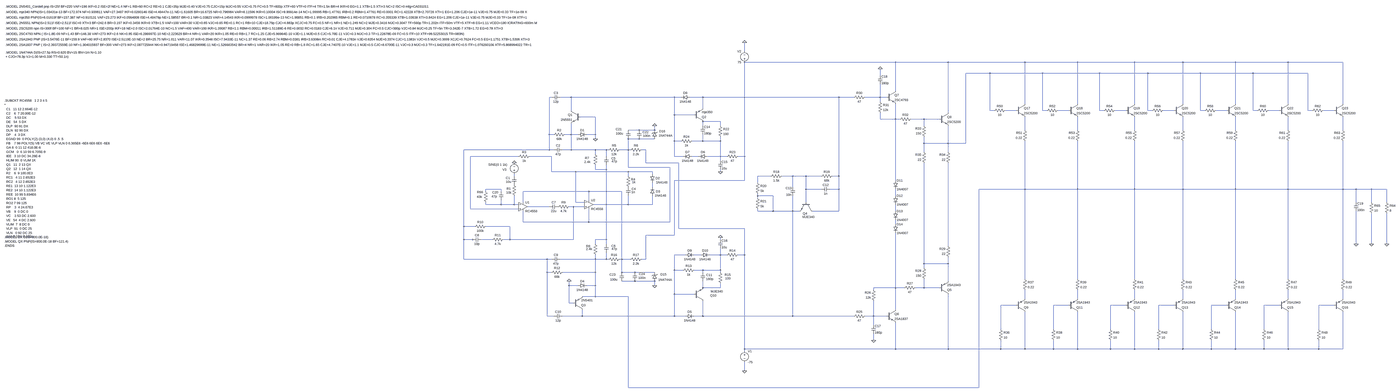
[diagram p0: schematic amplifier.asc, whole sheet]
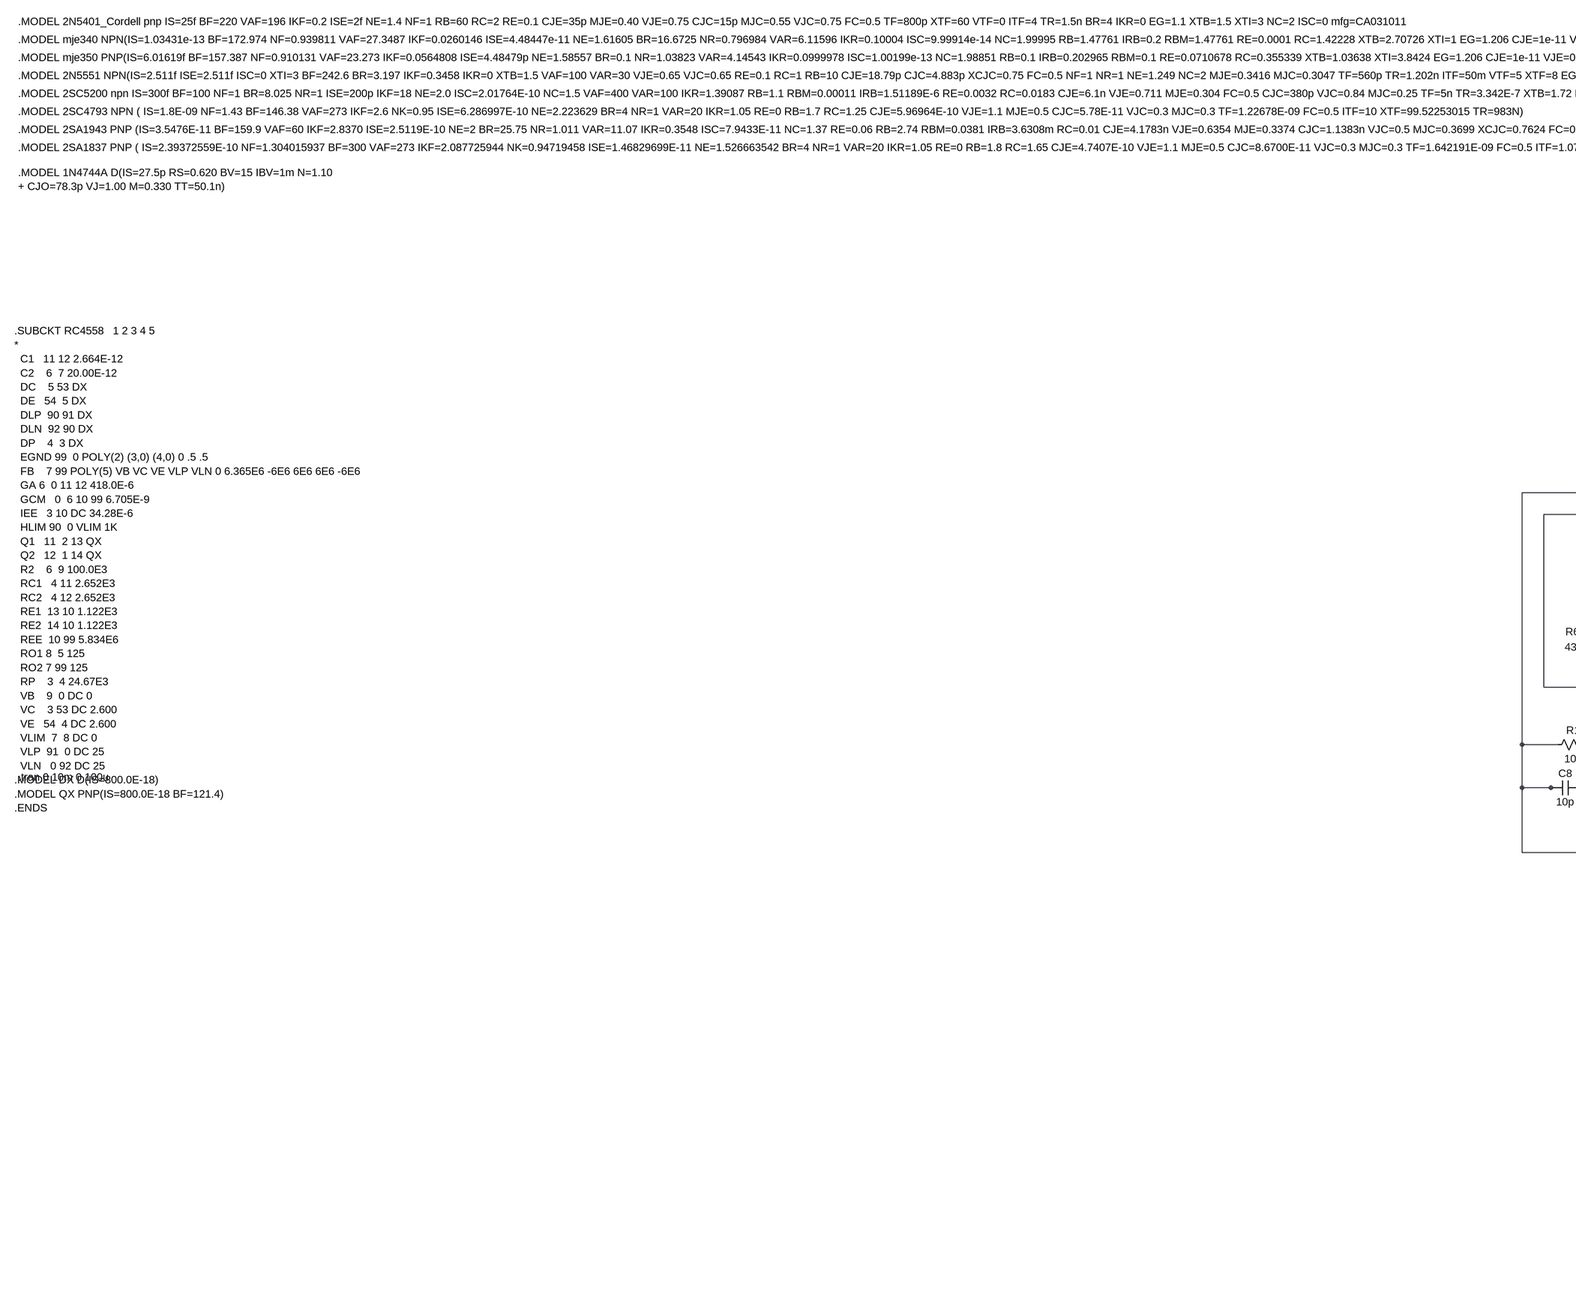
[diagram p1: schematic amplifier.asc, part, row 1 of 1, column 1 of 3]
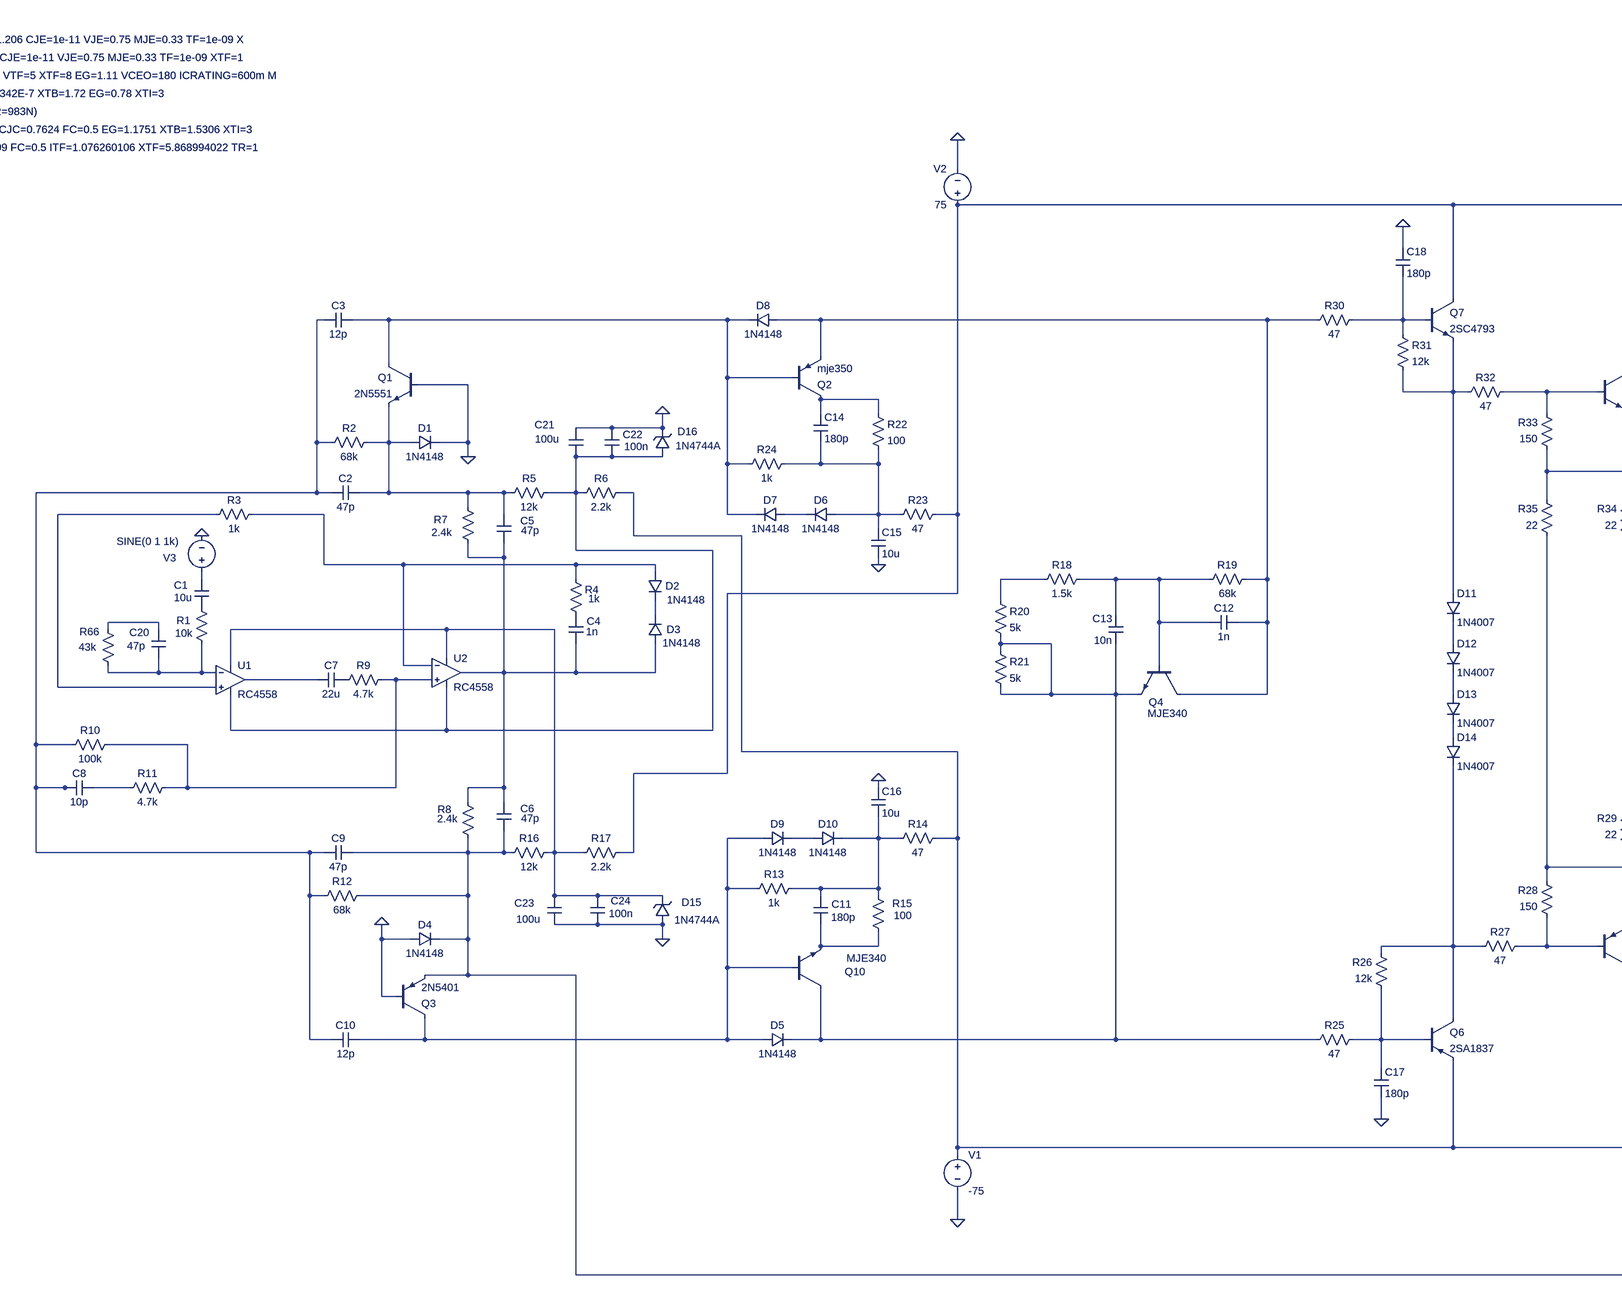
[diagram p2: schematic amplifier.asc, part, row 1 of 1, column 2 of 3]
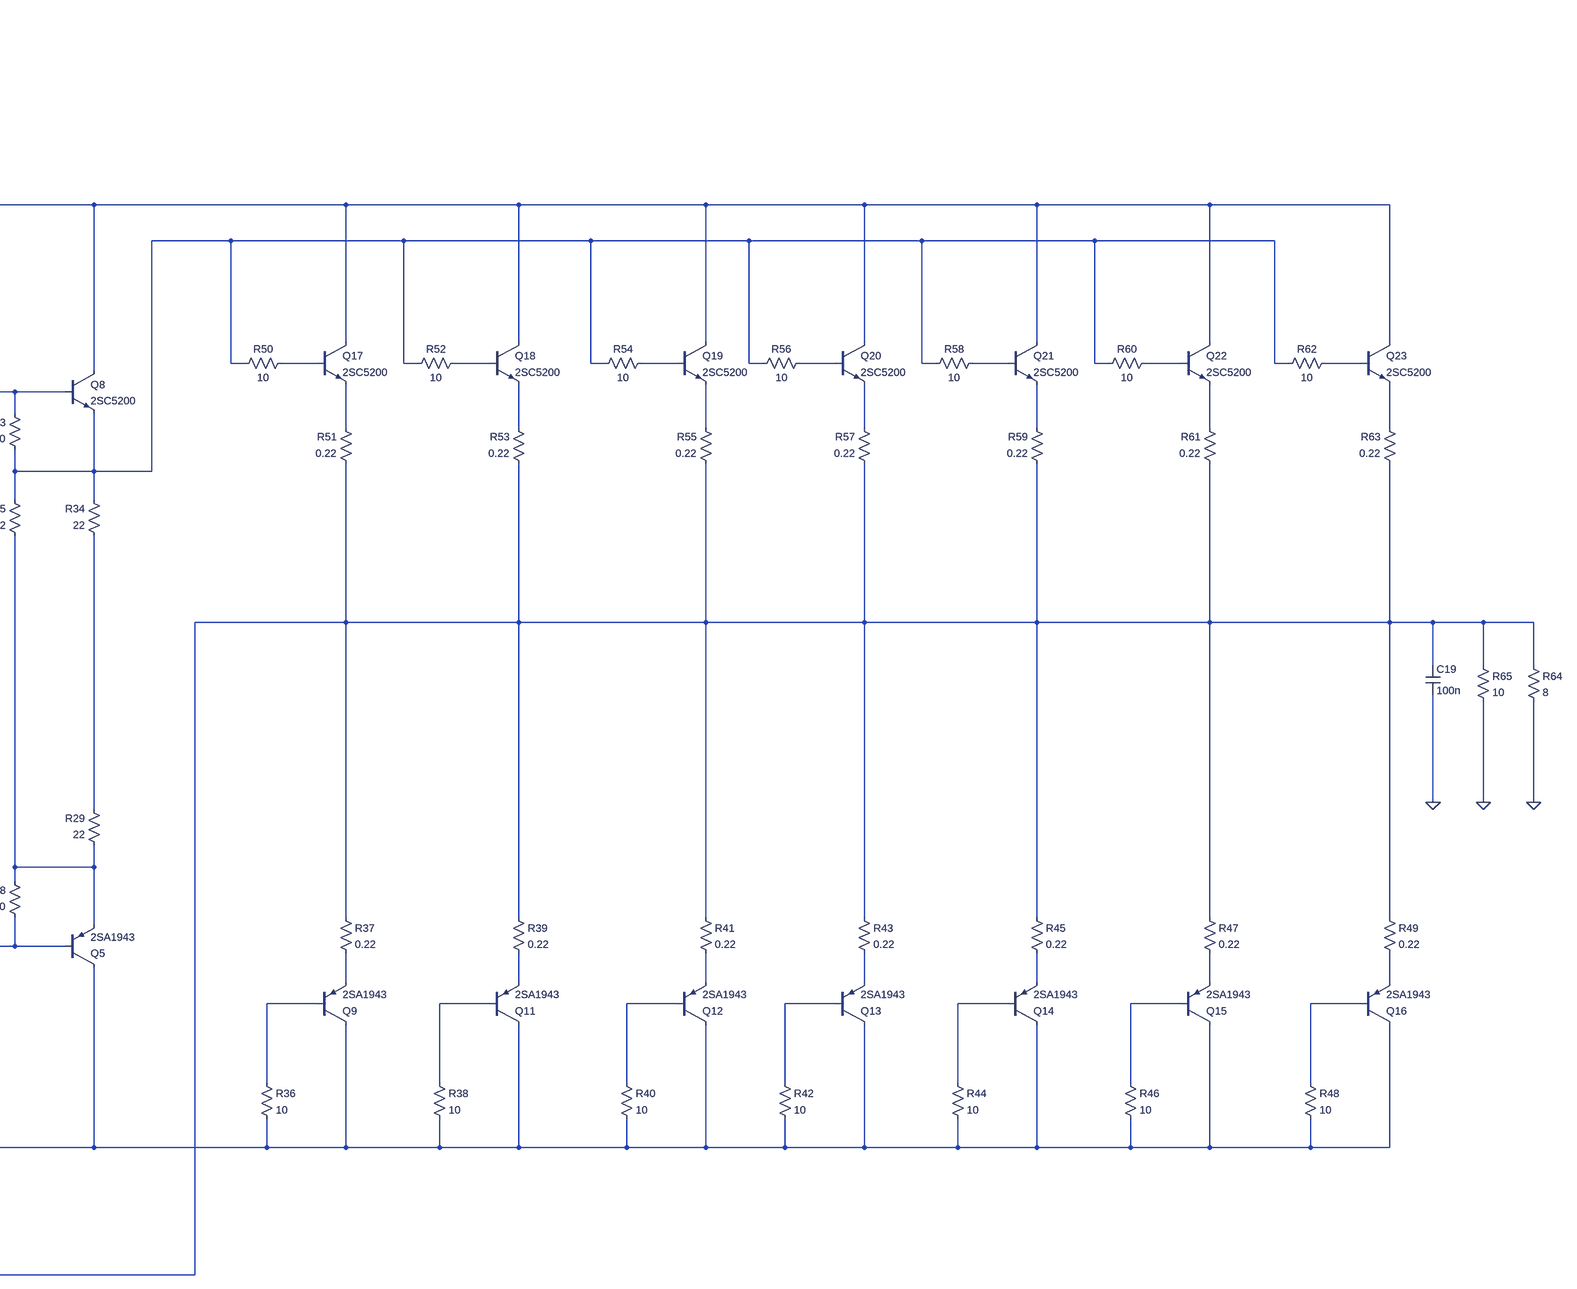
[diagram p3: schematic amplifier.asc, part, row 1 of 1, column 3 of 3]
amplifier.asc, the LTspice schematic file:
Version 4
SHEET 1 6164 1556
WIRE 1168 -1120 1168 -1184
WIRE 2400 -1040 1168 -1040
WIRE 2784 -1040 2400 -1040
WIRE 3344 -1040 2784 -1040
WIRE 3728 -1040 3344 -1040
WIRE 4144 -1040 3728 -1040
WIRE 4496 -1040 4144 -1040
WIRE 4880 -1040 4496 -1040
WIRE 5264 -1040 4880 -1040
WIRE 5664 -1040 5264 -1040
WIRE 3088 -960 2912 -960
WIRE 3472 -960 3088 -960
WIRE 3888 -960 3472 -960
WIRE 4240 -960 3888 -960
WIRE 4624 -960 4240 -960
WIRE 5008 -960 4624 -960
WIRE 5408 -960 5008 -960
WIRE 2288 -944 2288 -992
WIRE 2400 -832 2400 -1040
WIRE -240 -784 -256 -784
WIRE -96 -784 -176 -784
WIRE 656 -784 -96 -784
WIRE 704 -784 656 -784
WIRE 864 -784 768 -784
WIRE 1856 -784 864 -784
WIRE 2096 -784 1856 -784
WIRE 2288 -784 2288 -880
WIRE 2288 -784 2176 -784
WIRE 2336 -784 2288 -784
WIRE 2288 -752 2288 -784
WIRE 3344 -736 3344 -1040
WIRE 3728 -736 3728 -1040
WIRE 4144 -736 4144 -1040
WIRE 4496 -736 4496 -1040
WIRE 4880 -736 4880 -1040
WIRE 5264 -736 5264 -1040
WIRE 5664 -736 5664 -1040
WIRE 864 -704 864 -784
WIRE -96 -688 -96 -784
WIRE 3088 -688 3088 -960
WIRE 3120 -688 3088 -688
WIRE 3280 -688 3200 -688
WIRE 3472 -688 3472 -960
WIRE 3504 -688 3472 -688
WIRE 3664 -688 3584 -688
WIRE 3888 -688 3888 -960
WIRE 3920 -688 3888 -688
WIRE 4080 -688 4000 -688
WIRE 4240 -688 4240 -960
WIRE 4272 -688 4240 -688
WIRE 4432 -688 4352 -688
WIRE 4624 -688 4624 -960
WIRE 4656 -688 4624 -688
WIRE 4816 -688 4736 -688
WIRE 5008 -688 5008 -960
WIRE 5040 -688 5008 -688
WIRE 5200 -688 5120 -688
WIRE 5408 -688 5408 -960
WIRE 5440 -688 5408 -688
WIRE 5600 -688 5520 -688
WIRE 2784 -672 2784 -1040
WIRE 656 -656 656 -784
WIRE 800 -656 656 -656
WIRE 80 -640 -32 -640
WIRE 2288 -624 2288 -672
WIRE 2400 -624 2400 -736
WIRE 2400 -624 2288 -624
WIRE 2432 -624 2400 -624
WIRE 2608 -624 2512 -624
WIRE 2720 -624 2608 -624
WIRE 992 -608 864 -608
WIRE 864 -576 864 -608
WIRE 992 -576 992 -608
WIRE 2608 -576 2608 -624
WIRE 400 -544 320 -544
WIRE 512 -544 512 -576
WIRE 512 -544 400 -544
WIRE 3344 -544 3344 -640
WIRE 3728 -544 3728 -640
WIRE 4144 -544 4144 -640
WIRE 4496 -544 4496 -640
WIRE 4880 -544 4880 -640
WIRE 5264 -544 5264 -640
WIRE 5664 -544 5664 -640
WIRE -256 -512 -256 -784
WIRE -224 -512 -256 -512
WIRE -96 -512 -96 -592
WIRE -96 -512 -144 -512
WIRE -48 -512 -96 -512
WIRE 80 -512 80 -640
WIRE 80 -512 16 -512
WIRE 80 -480 80 -512
WIRE 400 -480 320 -480
WIRE 512 -480 400 -480
WIRE 656 -464 656 -656
WIRE 704 -464 656 -464
WIRE 864 -464 864 -512
WIRE 864 -464 784 -464
WIRE 992 -464 992 -496
WIRE 992 -464 864 -464
WIRE 2608 -448 2608 -496
WIRE 2784 -448 2784 -576
WIRE 2784 -448 2608 -448
WIRE 2912 -448 2912 -960
WIRE 2912 -448 2784 -448
WIRE -256 -400 -256 -512
WIRE -256 -400 -880 -400
WIRE -224 -400 -256 -400
WIRE -96 -400 -96 -512
WIRE -96 -400 -160 -400
WIRE 80 -400 -96 -400
WIRE 160 -400 80 -400
WIRE 176 -400 160 -400
WIRE 320 -400 320 -480
WIRE 320 -400 256 -400
WIRE 336 -400 320 -400
WIRE 448 -400 416 -400
WIRE 2608 -384 2608 -448
WIRE 2784 -384 2784 -448
WIRE 80 -368 80 -400
WIRE -480 -352 -832 -352
WIRE -240 -352 -400 -352
WIRE 160 -352 160 -400
WIRE 656 -352 656 -464
WIRE 720 -352 656 -352
WIRE 832 -352 784 -352
WIRE 992 -352 992 -464
WIRE 992 -352 896 -352
WIRE 1040 -352 992 -352
WIRE 1168 -352 1168 -1040
WIRE 1168 -352 1120 -352
WIRE 992 -320 992 -352
WIRE 448 -304 448 -400
WIRE 688 -304 448 -304
WIRE 320 -272 320 -400
WIRE 624 -272 320 -272
WIRE 80 -256 80 -288
WIRE 160 -256 160 -288
WIRE 160 -256 80 -256
WIRE -240 -240 -240 -352
WIRE -64 -240 -240 -240
WIRE 320 -240 -64 -240
WIRE 496 -240 320 -240
WIRE 992 -240 992 -256
WIRE 496 -224 496 -240
WIRE -512 -208 -512 -224
WIRE 320 -208 320 -240
WIRE 1360 -208 1264 -208
WIRE 1520 -208 1440 -208
WIRE 1616 -208 1520 -208
WIRE 1728 -208 1616 -208
WIRE 1856 -208 1856 -784
WIRE 1856 -208 1808 -208
WIRE 1168 -176 1168 -352
WIRE 1168 -176 656 -176
WIRE 2400 -176 2400 -624
WIRE 1264 -160 1264 -208
WIRE 496 -128 496 -160
WIRE 1520 -128 1520 -208
WIRE -608 -112 -720 -112
WIRE 1616 -112 1616 -208
WIRE 1728 -112 1616 -112
WIRE 1856 -112 1856 -208
WIRE 1856 -112 1792 -112
WIRE 3344 -112 3344 -464
WIRE 3344 -112 3008 -112
WIRE 3728 -112 3728 -464
WIRE 3728 -112 3344 -112
WIRE 4144 -112 4144 -464
WIRE 4144 -112 3728 -112
WIRE 4496 -112 4496 -464
WIRE 4496 -112 4144 -112
WIRE 4880 -112 4880 -464
WIRE 4880 -112 4496 -112
WIRE 5264 -112 5264 -464
WIRE 5264 -112 4880 -112
WIRE 5664 -112 5664 -464
WIRE 5664 -112 5264 -112
WIRE 5760 -112 5664 -112
WIRE 5872 -112 5760 -112
WIRE 5984 -112 5872 -112
WIRE -720 -96 -720 -112
WIRE -608 -96 -608 -112
WIRE 32 -96 -448 -96
WIRE 272 -96 32 -96
WIRE 1264 -64 1264 -80
WIRE 1376 -64 1264 -64
WIRE 2400 -64 2400 -112
WIRE 1264 -48 1264 -64
WIRE 32 -32 32 -96
WIRE -448 -16 -448 -96
WIRE -64 -16 -64 -240
WIRE 0 -16 -64 -16
WIRE 1616 -16 1616 -112
WIRE 5760 -16 5760 -112
WIRE 5872 -16 5872 -112
WIRE 5984 -16 5984 -112
WIRE -720 0 -720 -16
WIRE -608 0 -608 -32
WIRE -608 0 -720 0
WIRE -512 0 -512 -64
WIRE -512 0 -608 0
WIRE -480 0 -512 0
WIRE 160 0 160 -256
WIRE 160 0 64 0
WIRE 320 0 320 -64
WIRE 320 0 160 0
WIRE 496 0 496 -64
WIRE 496 0 320 0
WIRE -256 16 -416 16
WIRE -80 16 -112 16
WIRE 0 16 -80 16
WIRE -832 32 -832 -352
WIRE -480 32 -832 32
WIRE 1264 48 1264 32
WIRE 1376 48 1376 -64
WIRE 1376 48 1264 48
WIRE 1520 48 1520 -64
WIRE 1520 48 1376 48
WIRE 1568 48 1520 48
WIRE 1856 48 1856 -112
WIRE 1856 48 1664 48
WIRE 2400 48 2400 0
WIRE -448 128 -448 48
WIRE 32 128 32 32
WIRE 32 128 -448 128
WIRE 624 128 624 -272
WIRE 624 128 32 128
WIRE 2400 144 2400 112
WIRE -880 160 -880 -400
WIRE -800 160 -880 160
WIRE -544 160 -720 160
WIRE 688 176 688 -304
WIRE 1168 176 688 176
WIRE 656 224 656 -176
WIRE 656 224 448 224
WIRE -880 256 -880 160
WIRE -816 256 -880 256
WIRE -800 256 -816 256
WIRE -672 256 -752 256
WIRE -544 256 -544 160
WIRE -544 256 -592 256
WIRE -80 256 -80 16
WIRE -80 256 -544 256
WIRE 160 256 160 0
WIRE 160 256 80 256
WIRE 992 256 992 240
WIRE 80 288 80 256
WIRE 160 288 160 256
WIRE 5760 288 5760 48
WIRE 5872 288 5872 64
WIRE 5984 288 5984 64
WIRE 2784 304 2784 -304
WIRE 736 368 656 368
WIRE 848 368 800 368
WIRE 992 368 992 320
WIRE 992 368 912 368
WIRE 1040 368 992 368
WIRE 1168 368 1168 176
WIRE 1168 368 1120 368
WIRE -880 400 -880 256
WIRE -272 400 -880 400
WIRE -240 400 -272 400
WIRE 80 400 80 368
WIRE 80 400 -176 400
WIRE 160 400 160 352
WIRE 160 400 80 400
WIRE 176 400 160 400
WIRE 272 400 272 -96
WIRE 272 400 256 400
WIRE 336 400 272 400
WIRE 448 400 448 224
WIRE 448 400 416 400
WIRE 2608 432 2608 -304
WIRE 2784 432 2784 384
WIRE 2784 432 2608 432
WIRE 2608 464 2608 432
WIRE 656 480 656 368
WIRE 720 480 656 480
WIRE 864 480 800 480
WIRE 992 480 992 368
WIRE 992 480 864 480
WIRE -272 496 -272 400
WIRE -240 496 -272 496
WIRE 80 496 80 400
WIRE 80 496 -160 496
WIRE 272 496 272 400
WIRE 368 496 272 496
WIRE 512 496 368 496
WIRE 864 496 864 480
WIRE 992 496 992 480
WIRE 3344 544 3344 -112
WIRE 3728 544 3728 -112
WIRE 4144 544 4144 -112
WIRE 4496 544 4496 -112
WIRE 4880 544 4880 -112
WIRE 5264 544 5264 -112
WIRE 5664 544 5664 -112
WIRE 368 560 272 560
WIRE 512 560 368 560
WIRE 2784 560 2784 432
WIRE -112 592 -112 560
WIRE -48 592 -112 592
WIRE 80 592 80 496
WIRE 80 592 16 592
WIRE 512 592 512 560
WIRE 864 608 864 560
WIRE 992 608 992 576
WIRE 992 608 864 608
WIRE 2400 608 2400 208
WIRE 2400 608 2240 608
WIRE 2464 608 2400 608
WIRE 2608 608 2608 544
WIRE 2608 608 2544 608
WIRE 2720 608 2608 608
WIRE 2240 624 2240 608
WIRE 656 656 656 480
WIRE 800 656 656 656
WIRE 80 672 80 592
WIRE 80 672 -16 672
WIRE 320 672 80 672
WIRE 3344 688 3344 624
WIRE 3728 688 3728 624
WIRE 4144 688 4144 624
WIRE 4496 688 4496 624
WIRE 4880 688 4880 624
WIRE 5264 688 5264 624
WIRE 5664 688 5664 624
WIRE -112 720 -112 592
WIRE -80 720 -112 720
WIRE 3280 736 3168 736
WIRE 3664 736 3552 736
WIRE 4080 736 3968 736
WIRE 4432 736 4320 736
WIRE 4816 736 4704 736
WIRE 5200 736 5088 736
WIRE 5600 736 5488 736
WIRE 2400 768 2400 608
WIRE -272 816 -272 496
WIRE -224 816 -272 816
WIRE -16 816 -16 768
WIRE -16 816 -160 816
WIRE 656 816 656 656
WIRE 656 816 -16 816
WIRE 736 816 656 816
WIRE 864 816 864 704
WIRE 864 816 800 816
WIRE 1520 816 1520 48
WIRE 1520 816 864 816
WIRE 2096 816 1520 816
WIRE 2240 816 2240 704
WIRE 2240 816 2176 816
WIRE 2336 816 2240 816
WIRE 2240 880 2240 816
WIRE 3168 912 3168 736
WIRE 3552 912 3552 736
WIRE 3968 912 3968 736
WIRE 4320 912 4320 736
WIRE 4704 912 4704 736
WIRE 5088 912 5088 736
WIRE 5488 912 5488 736
WIRE 2240 992 2240 944
WIRE 1168 1056 1168 368
WIRE 2400 1056 2400 864
WIRE 2400 1056 1168 1056
WIRE 2784 1056 2784 656
WIRE 2784 1056 2400 1056
WIRE 3168 1056 3168 992
WIRE 3168 1056 2784 1056
WIRE 3344 1056 3344 784
WIRE 3344 1056 3168 1056
WIRE 3552 1056 3552 992
WIRE 3552 1056 3344 1056
WIRE 3728 1056 3728 784
WIRE 3728 1056 3552 1056
WIRE 3968 1056 3968 992
WIRE 3968 1056 3728 1056
WIRE 4144 1056 4144 784
WIRE 4144 1056 3968 1056
WIRE 4320 1056 4320 992
WIRE 4320 1056 4144 1056
WIRE 4496 1056 4496 784
WIRE 4496 1056 4320 1056
WIRE 4704 1056 4704 992
WIRE 4704 1056 4496 1056
WIRE 4880 1056 4880 784
WIRE 4880 1056 4704 1056
WIRE 5088 1056 5088 992
WIRE 5088 1056 4880 1056
WIRE 5264 1056 5264 784
WIRE 5264 1056 5088 1056
WIRE 5488 1056 5488 992
WIRE 5488 1056 5264 1056
WIRE 5664 1056 5664 784
WIRE 5664 1056 5488 1056
WIRE 1168 1072 1168 1056
WIRE 1168 1216 1168 1152
WIRE 320 1552 320 672
WIRE 3008 1552 3008 -112
WIRE 3008 1552 320 1552
FLAG 80 -480 0
FLAG -112 560 0
FLAG 1168 1216 0
FLAG 1168 -1184 0
FLAG 992 240 0
FLAG 992 -240 0
FLAG 2240 992 0
FLAG 2288 -992 0
FLAG 5984 288 0
FLAG 5872 288 0
FLAG 5760 288 0
FLAG -512 -304 0
FLAG 512 592 0
FLAG 512 -576 0
SYMBOL npn -32 -688 M0
SYMATTR InstName Q1
SYMATTR Value 2N5551
SYMBOL pnp 800 -608 M180
SYMATTR InstName Q2
SYMATTR Value mje350
SYMBOL pnp -80 768 M180
SYMATTR InstName Q3
SYMATTR Value 2N5401
SYMBOL npn 1664 -16 R90
WINDOW 0 82 39 VRight 2
WINDOW 3 107 -15 VRight 2
SYMATTR InstName Q4
SYMATTR Value MJE340
SYMBOL OpAmps\\opamp2 -448 -48 R0
SYMATTR InstName U1
SYMATTR Value RC4558
SYMBOL OpAmps\\opamp2 32 -64 R0
SYMATTR InstName U2
SYMATTR Value RC4558
SYMBOL res -496 -48 R180
WINDOW 0 41 68 Left 2
WINDOW 3 36 40 Left 2
SYMATTR InstName R1
SYMATTR Value 10k
SYMBOL cap -496 -144 R180
WINDOW 0 47 50 Left 2
WINDOW 3 37 23 Left 2
SYMATTR InstName C1
SYMATTR Value 10u
SYMBOL diode -48 -496 R270
WINDOW 0 32 32 VTop 2
WINDOW 3 0 32 VBottom 2
SYMATTR InstName D1
SYMATTR Value 1N4148
SYMBOL res -128 -528 R90
WINDOW 0 0 56 VBottom 2
WINDOW 3 32 56 VTop 2
SYMATTR InstName R2
SYMATTR Value 68k
SYMBOL cap -160 -416 R90
WINDOW 0 0 32 VBottom 2
WINDOW 3 32 32 VTop 2
SYMATTR InstName C2
SYMATTR Value 47p
SYMBOL cap -176 -800 R90
WINDOW 0 0 32 VBottom 2
WINDOW 3 32 32 VTop 2
SYMATTR InstName C3
SYMATTR Value 12p
SYMBOL res -384 -368 R90
WINDOW 0 0 56 VBottom 2
WINDOW 3 32 56 VTop 2
SYMATTR InstName R3
SYMATTR Value 1k
SYMBOL res 304 -224 R0
WINDOW 3 43 60 Left 2
SYMATTR Value 1k
SYMATTR InstName R4
SYMBOL cap 304 -128 R0
WINDOW 0 40 14 Left 2
WINDOW 3 38 37 Left 2
SYMATTR InstName C4
SYMATTR Value 1n
SYMBOL diode 480 -224 R0
WINDOW 0 39 31 Left 2
WINDOW 3 42 62 Left 2
SYMATTR InstName D2
SYMATTR Value 1N4148
SYMBOL diode 512 -64 R180
WINDOW 0 -40 32 Left 2
WINDOW 3 -85 2 Left 2
SYMATTR InstName D3
SYMATTR Value 1N4148
SYMBOL res 272 -416 R90
WINDOW 0 0 56 VBottom 2
WINDOW 3 32 56 VTop 2
SYMATTR InstName R5
SYMATTR Value 12k
SYMBOL res 432 -416 R90
WINDOW 0 0 56 VBottom 2
WINDOW 3 32 56 VTop 2
SYMATTR InstName R6
SYMATTR Value 2.2k
SYMBOL res 96 -272 R180
WINDOW 0 61 68 Left 2
WINDOW 3 51 40 Left 2
SYMATTR InstName R7
SYMATTR Value 2.4k
SYMBOL cap 144 -352 R0
WINDOW 0 52 14 Left 2
WINDOW 3 54 36 Left 2
SYMATTR InstName C5
SYMATTR Value 47p
SYMBOL res 64 272 R0
WINDOW 0 -52 32 Left 2
WINDOW 3 -53 53 Left 2
SYMATTR InstName R8
SYMATTR Value 2.4k
SYMBOL cap -192 0 R90
WINDOW 0 0 32 VBottom 2
WINDOW 3 32 32 VTop 2
SYMATTR InstName C7
SYMATTR Value 22u
SYMBOL res -96 0 R90
WINDOW 0 0 56 VBottom 2
WINDOW 3 32 56 VTop 2
SYMATTR InstName R9
SYMATTR Value 4.7k
SYMBOL res -704 144 R90
WINDOW 0 0 56 VBottom 2
WINDOW 3 32 56 VTop 2
SYMATTR InstName R10
SYMATTR Value 100k
SYMBOL cap -752 240 R90
WINDOW 0 0 32 VBottom 2
WINDOW 3 32 32 VTop 2
SYMATTR InstName C8
SYMATTR Value 10p
SYMBOL res -576 240 R90
WINDOW 0 0 56 VBottom 2
WINDOW 3 32 56 VTop 2
SYMATTR InstName R11
SYMATTR Value 4.7k
SYMBOL diode -48 608 R270
WINDOW 0 32 32 VTop 2
WINDOW 3 0 32 VBottom 2
SYMATTR InstName D4
SYMATTR Value 1N4148
SYMBOL cap -176 384 R90
WINDOW 0 0 32 VBottom 2
WINDOW 3 32 32 VTop 2
SYMATTR InstName C9
SYMATTR Value 47p
SYMBOL res -144 480 R90
WINDOW 0 0 56 VBottom 2
WINDOW 3 32 56 VTop 2
SYMATTR InstName R12
SYMATTR Value 68k
SYMBOL cap 144 288 R0
WINDOW 0 52 14 Left 2
WINDOW 3 54 36 Left 2
SYMATTR InstName C6
SYMATTR Value 47p
SYMBOL cap -160 800 R90
WINDOW 0 0 32 VBottom 2
WINDOW 3 32 32 VTop 2
SYMATTR InstName C10
SYMATTR Value 12p
SYMBOL diode 736 832 R270
WINDOW 0 32 32 VTop 2
WINDOW 3 0 32 VBottom 2
SYMATTR InstName D5
SYMATTR Value 1N4148
SYMBOL res 816 464 R90
WINDOW 0 0 56 VBottom 2
WINDOW 3 32 56 VTop 2
SYMATTR InstName R13
SYMATTR Value 1k
SYMBOL diode 896 -336 M270
WINDOW 0 32 32 VTop 2
WINDOW 3 0 32 VBottom 2
SYMATTR InstName D6
SYMATTR Value 1N4148
SYMBOL diode 784 -336 M270
WINDOW 0 32 32 VTop 2
WINDOW 3 0 32 VBottom 2
SYMATTR InstName D7
SYMATTR Value 1N4148
SYMBOL res 1136 352 R90
WINDOW 0 0 56 VBottom 2
WINDOW 3 32 56 VTop 2
SYMATTR InstName R14
SYMATTR Value 47
SYMBOL res 1008 592 R180
WINDOW 0 -59 79 Left 2
WINDOW 3 -59 52 Left 2
SYMATTR InstName R15
SYMATTR Value 100
SYMBOL cap 848 496 R0
WINDOW 0 40 19 Left 2
WINDOW 3 39 48 Left 2
SYMATTR InstName C11
SYMATTR Value 180p
SYMBOL res 272 384 R90
WINDOW 0 0 56 VBottom 2
WINDOW 3 32 56 VTop 2
SYMATTR InstName R16
SYMATTR Value 12k
SYMBOL res 432 384 R90
WINDOW 0 0 56 VBottom 2
WINDOW 3 32 56 VTop 2
SYMATTR InstName R17
SYMATTR Value 2.2k
SYMBOL res 1456 -224 R90
WINDOW 0 0 56 VBottom 2
WINDOW 3 32 56 VTop 2
SYMATTR InstName R18
SYMATTR Value 1.5k
SYMBOL res 1824 -224 R90
WINDOW 0 0 56 VBottom 2
WINDOW 3 32 56 VTop 2
SYMATTR InstName R19
SYMATTR Value 68k
SYMBOL cap 1792 -128 R90
WINDOW 0 0 32 VBottom 2
WINDOW 3 32 32 VTop 2
SYMATTR InstName C12
SYMATTR Value 1n
SYMBOL cap 1536 -64 R180
WINDOW 0 24 56 Left 2
WINDOW 3 24 8 Left 2
SYMATTR InstName C13
SYMATTR Value 10n
SYMBOL res 1248 -176 R0
SYMATTR InstName R20
SYMATTR Value 5k
SYMBOL res 1248 -64 R0
SYMATTR InstName R21
SYMATTR Value 5k
SYMBOL diode 768 -800 R90
WINDOW 0 0 32 VBottom 2
WINDOW 3 32 32 VTop 2
SYMATTR InstName D8
SYMATTR Value 1N4148
SYMBOL cap 848 -576 R0
SYMATTR InstName C14
SYMATTR Value 180p
SYMBOL res 976 -592 R0
SYMATTR InstName R22
SYMATTR Value 100
SYMBOL res 1136 -368 R90
WINDOW 0 0 56 VBottom 2
WINDOW 3 32 56 VTop 2
SYMATTR InstName R23
SYMATTR Value 47
SYMBOL res 800 -480 R90
WINDOW 0 0 56 VBottom 2
WINDOW 3 32 56 VTop 2
SYMATTR InstName R24
SYMATTR Value 1k
SYMBOL diode 736 352 M90
WINDOW 0 0 32 VBottom 2
WINDOW 3 32 32 VTop 2
SYMATTR InstName D9
SYMATTR Value 1N4148
SYMBOL diode 848 352 M90
WINDOW 0 0 32 VBottom 2
WINDOW 3 32 32 VTop 2
SYMATTR InstName D10
SYMATTR Value 1N4148
SYMBOL voltage 1168 1056 R0
SYMATTR InstName V1
SYMATTR Value -75
SYMBOL voltage 1168 -1024 R180
WINDOW 0 24 96 Left 2
WINDOW 3 24 16 Left 2
SYMATTR InstName V2
SYMATTR Value 75
SYMBOL cap 976 -320 R0
SYMATTR InstName C15
SYMATTR Value 10u
SYMBOL cap 976 256 R0
SYMATTR InstName C16
SYMATTR Value 10u
SYMBOL res 2192 800 R90
WINDOW 0 0 56 VBottom 2
WINDOW 3 32 56 VTop 2
SYMATTR InstName R25
SYMATTR Value 47
SYMBOL res 2256 720 R180
WINDOW 0 36 76 Left 2
WINDOW 3 36 40 Left 2
SYMATTR InstName R26
SYMATTR Value 12k
SYMBOL cap 2224 880 R0
SYMATTR InstName C17
SYMATTR Value 180p
SYMBOL res 2560 592 R90
WINDOW 0 0 56 VBottom 2
WINDOW 3 32 56 VTop 2
SYMATTR InstName R27
SYMATTR Value 47
SYMBOL res 2624 560 R180
WINDOW 0 36 76 Left 2
WINDOW 3 36 40 Left 2
SYMATTR InstName R28
SYMATTR Value 150
SYMBOL res 2800 400 R180
WINDOW 0 36 76 Left 2
WINDOW 3 36 40 Left 2
SYMATTR InstName R29
SYMATTR Value 22
SYMBOL pnp 2336 768 R0
SYMATTR InstName Q6
SYMATTR Value 2SA1837
SYMBOL pnp 2720 656 M180
SYMATTR InstName Q5
SYMATTR Value 2SA1943
SYMBOL res 2192 -800 R90
WINDOW 0 0 56 VBottom 2
WINDOW 3 32 56 VTop 2
SYMATTR InstName R30
SYMATTR Value 47
SYMBOL res 2272 -768 R0
SYMATTR InstName R31
SYMATTR Value 12k
SYMBOL cap 2272 -944 R0
SYMATTR InstName C18
SYMATTR Value 180p
SYMBOL diode 2384 -176 R0
SYMATTR InstName D11
SYMATTR Value 1N4007
SYMBOL diode 2384 -64 R0
SYMATTR InstName D12
SYMATTR Value 1N4007
SYMBOL diode 2384 48 R0
SYMATTR InstName D13
SYMATTR Value 1N4007
SYMBOL diode 2384 144 R0
SYMATTR InstName D14
SYMATTR Value 1N4007
SYMBOL npn 2336 -832 R0
SYMATTR InstName Q7
SYMATTR Value 2SC4793
SYMBOL res 2528 -640 R90
WINDOW 0 0 56 VBottom 2
WINDOW 3 32 56 VTop 2
SYMATTR InstName R32
SYMATTR Value 47
SYMBOL res 2624 -480 R180
WINDOW 0 36 76 Left 2
WINDOW 3 36 40 Left 2
SYMATTR InstName R33
SYMATTR Value 150
SYMBOL res 2800 -288 R180
WINDOW 0 36 76 Left 2
WINDOW 3 36 40 Left 2
SYMATTR InstName R34
SYMATTR Value 22
SYMBOL res 2624 -288 R180
WINDOW 0 36 76 Left 2
WINDOW 3 36 40 Left 2
SYMATTR InstName R35
SYMATTR Value 22
SYMBOL npn 2720 -672 R0
SYMATTR InstName Q8
SYMATTR Value 2SC5200
SYMBOL res 3152 896 R0
SYMATTR InstName R36
SYMATTR Value 10
SYMBOL pnp 3280 784 M180
SYMATTR InstName Q9
SYMATTR Value 2SA1943
SYMBOL res 3328 528 R0
SYMATTR InstName R37
SYMATTR Value 0.22
SYMBOL npn 800 704 M180
WINDOW 0 163 39 Right 2
WINDOW 3 210 69 Right 2
SYMATTR InstName Q10
SYMATTR Value MJE340
SYMBOL res 3536 896 R0
SYMATTR InstName R38
SYMATTR Value 10
SYMBOL pnp 3664 784 M180
SYMATTR InstName Q11
SYMATTR Value 2SA1943
SYMBOL res 3712 528 R0
SYMATTR InstName R39
SYMATTR Value 0.22
SYMBOL res 3952 896 R0
SYMATTR InstName R40
SYMATTR Value 10
SYMBOL pnp 4080 784 M180
SYMATTR InstName Q12
SYMATTR Value 2SA1943
SYMBOL res 4128 528 R0
SYMATTR InstName R41
SYMATTR Value 0.22
SYMBOL res 4304 896 R0
SYMATTR InstName R42
SYMATTR Value 10
SYMBOL pnp 4432 784 M180
SYMATTR InstName Q13
SYMATTR Value 2SA1943
SYMBOL res 4480 528 R0
SYMATTR InstName R43
SYMATTR Value 0.22
SYMBOL res 4688 896 R0
SYMATTR InstName R44
SYMATTR Value 10
SYMBOL pnp 4816 784 M180
SYMATTR InstName Q14
SYMATTR Value 2SA1943
SYMBOL res 4864 528 R0
SYMATTR InstName R45
SYMATTR Value 0.22
SYMBOL res 5072 896 R0
SYMATTR InstName R46
SYMATTR Value 10
SYMBOL pnp 5200 784 M180
SYMATTR InstName Q15
SYMATTR Value 2SA1943
SYMBOL res 5248 528 R0
SYMATTR InstName R47
SYMATTR Value 0.22
SYMBOL res 5472 896 R0
SYMATTR InstName R48
SYMATTR Value 10
SYMBOL pnp 5600 784 M180
SYMATTR InstName Q16
SYMATTR Value 2SA1943
SYMBOL res 5648 528 R0
SYMATTR InstName R49
SYMATTR Value 0.22
SYMBOL res 3216 -704 R90
WINDOW 0 0 56 VBottom 2
WINDOW 3 32 56 VTop 2
SYMATTR InstName R50
SYMATTR Value 10
SYMBOL res 3360 -448 R180
WINDOW 0 36 76 Left 2
WINDOW 3 36 40 Left 2
SYMATTR InstName R51
SYMATTR Value 0.22
SYMBOL npn 3280 -736 R0
SYMATTR InstName Q17
SYMATTR Value 2SC5200
SYMBOL res 3600 -704 R90
WINDOW 0 0 56 VBottom 2
WINDOW 3 32 56 VTop 2
SYMATTR InstName R52
SYMATTR Value 10
SYMBOL res 3744 -448 R180
WINDOW 0 36 76 Left 2
WINDOW 3 36 40 Left 2
SYMATTR InstName R53
SYMATTR Value 0.22
SYMBOL npn 3664 -736 R0
SYMATTR InstName Q18
SYMATTR Value 2SC5200
SYMBOL res 4016 -704 R90
WINDOW 0 0 56 VBottom 2
WINDOW 3 32 56 VTop 2
SYMATTR InstName R54
SYMATTR Value 10
SYMBOL res 4160 -448 R180
WINDOW 0 36 76 Left 2
WINDOW 3 36 40 Left 2
SYMATTR InstName R55
SYMATTR Value 0.22
SYMBOL npn 4080 -736 R0
SYMATTR InstName Q19
SYMATTR Value 2SC5200
SYMBOL res 4368 -704 R90
WINDOW 0 0 56 VBottom 2
WINDOW 3 32 56 VTop 2
SYMATTR InstName R56
SYMATTR Value 10
SYMBOL res 4512 -448 R180
WINDOW 0 36 76 Left 2
WINDOW 3 36 40 Left 2
SYMATTR InstName R57
SYMATTR Value 0.22
SYMBOL npn 4432 -736 R0
SYMATTR InstName Q20
SYMATTR Value 2SC5200
SYMBOL res 4752 -704 R90
WINDOW 0 0 56 VBottom 2
WINDOW 3 32 56 VTop 2
SYMATTR InstName R58
SYMATTR Value 10
SYMBOL res 4896 -448 R180
WINDOW 0 36 76 Left 2
WINDOW 3 36 40 Left 2
SYMATTR InstName R59
SYMATTR Value 0.22
SYMBOL npn 4816 -736 R0
SYMATTR InstName Q21
SYMATTR Value 2SC5200
SYMBOL res 5136 -704 R90
WINDOW 0 0 56 VBottom 2
WINDOW 3 32 56 VTop 2
SYMATTR InstName R60
SYMATTR Value 10
SYMBOL res 5280 -448 R180
WINDOW 0 36 76 Left 2
WINDOW 3 36 40 Left 2
SYMATTR InstName R61
SYMATTR Value 0.22
SYMBOL npn 5200 -736 R0
SYMATTR InstName Q22
SYMATTR Value 2SC5200
SYMBOL res 5536 -704 R90
WINDOW 0 0 56 VBottom 2
WINDOW 3 32 56 VTop 2
SYMATTR InstName R62
SYMATTR Value 10
SYMBOL res 5680 -448 R180
WINDOW 0 36 76 Left 2
WINDOW 3 36 40 Left 2
SYMATTR InstName R63
SYMATTR Value 0.22
SYMBOL npn 5600 -736 R0
SYMATTR InstName Q23
SYMATTR Value 2SC5200
SYMBOL res 5968 -32 R0
SYMATTR InstName R64
SYMATTR Value 8
SYMBOL res 5856 -32 R0
SYMATTR InstName R65
SYMATTR Value 10
SYMBOL cap 5744 -16 R0
SYMATTR InstName C19
SYMATTR Value 100n
SYMBOL voltage -512 -208 R180
WINDOW 0 71 63 Bottom 2
WINDOW 3 120 68 Top 2
WINDOW 123 0 0 Left 0
WINDOW 39 0 0 Left 0
SYMATTR InstName V3
SYMATTR Value SINE(0 1 1k)
SYMBOL cap -624 -96 R0
WINDOW 0 -49 7 Left 2
WINDOW 3 -54 37 Left 2
SYMATTR InstName C20
SYMATTR Value 47p
SYMBOL res -736 -112 R0
WINDOW 0 -48 21 Left 2
WINDOW 3 -49 55 Left 2
SYMATTR InstName R66
SYMATTR Value 43k
SYMBOL cap 304 -544 R0
WINDOW 0 -76 -7 Left 2
WINDOW 3 -75 25 Left 2
SYMATTR InstName C21
SYMATTR Value 100u
SYMBOL cap 384 -544 R0
WINDOW 0 40 15 Left 2
WINDOW 3 43 41 Left 2
SYMATTR InstName C22
SYMATTR Value 100n
SYMBOL cap 256 496 R0
WINDOW 0 -73 16 Left 2
WINDOW 3 -69 52 Left 2
SYMATTR InstName C23
SYMATTR Value 100u
SYMBOL cap 352 496 R0
WINDOW 0 45 11 Left 2
WINDOW 3 41 40 Left 2
SYMATTR InstName C24
SYMATTR Value 100n
SYMBOL zener 528 560 R180
WINDOW 0 -71 49 Left 2
WINDOW 3 -111 10 Left 2
SYMATTR InstName D15
SYMATTR Value 1N4744A
SYMBOL zener 528 -480 R180
WINDOW 0 -62 56 Left 2
WINDOW 3 -114 24 Left 2
SYMATTR InstName D16
SYMATTR Value 1N4744A
TEXT -4224 232 Left 2 !.tran 0 10m 0 100u
TEXT -4224 -1448 Left 2 !.MODEL 2N5401_Cordell pnp IS=25f BF=220 VAF=196 IKF=0.2 ISE=2f NE=1.4 NF=1 RB=60 RC=2 RE=0.1 CJE=35p MJE=0.40 VJE=0.75 CJC=15p MJC=0.55 VJC=0.75 FC=0.5 TF=800p XTF=60 VTF=0 ITF=4 TR=1.5n BR=4 IKR=0 EG=1.1 XTB=1.5 XTI=3 NC=2 ISC=0 mfg=CA031011
TEXT -4224 -1408 Left 2 !.MODEL mje340 NPN(IS=1.03431e-13 BF=172.974 NF=0.939811 VAF=27.3487 IKF=0.0260146 ISE=4.48447e-11 NE=1.61605 BR=16.6725 NR=0.796984 VAR=6.11596 IKR=0.10004 ISC=9.99914e-14 NC=1.99995 RB=1.47761 IRB=0.2 RBM=1.47761 RE=0.0001 RC=1.42228 XTB=2.70726 XTI=1 EG=1.206 CJE=1e-11 VJE=0.75 MJE=0.33 TF=1e-09 XTF=1 VTF=10 ITF=0.01 CJC=1e-11 VJC=0.75 MJC=0.33 XCJC=0.9 FC=0.5 CJS=0 VJS=0.75 MJS=0.5 TR=1e-07 PTF=0 Vceo=300 Icrating=0.5A mfg=OnSemi)
TEXT -4224 -1368 Left 2 !.MODEL mje350 PNP(IS=6.01619f BF=157.387 NF=0.910131 VAF=23.273 IKF=0.0564808 ISE=4.48479p NE=1.58557 BR=0.1 NR=1.03823 VAR=4.14543 IKR=0.0999978 ISC=1.00199e-13 NC=1.98851 RB=0.1 IRB=0.202965 RBM=0.1 RE=0.0710678 RC=0.355339 XTB=1.03638 XTI=3.8424 EG=1.206 CJE=1e-11 VJE=0.75 MJE=0.33 TF=1e-09 XTF=1 VTF=10 ITF=0.01 CJC=1e-11 VJC=0.75 MJC=0.33 XCJC=0.9 FC=0.5 CJS=0 VJS=0.75 MJS=0.5 TR=1e-07 PTF=0 Vceo=300 Icrating=0.5A mfg=OnSemi)
TEXT -4224 -1328 Left 2 !.MODEL 2N5551 NPN(IS=2.511f ISE=2.511f ISC=0 XTI=3 BF=242.6 BR=3.197 IKF=0.3458 IKR=0 XTB=1.5 VAF=100 VAR=30 VJE=0.65 VJC=0.65 RE=0.1 RC=1 RB=10 CJE=18.79p CJC=4.883p XCJC=0.75 FC=0.5 NF=1 NR=1 NE=1.249 NC=2 MJE=0.3416 MJC=0.3047 TF=560p TR=1.202n ITF=50m VTF=5 XTF=8 EG=1.11 VCEO=180 ICRATING=600m MFG=NSC)
TEXT -4232 -760 Left 2 !.SUBCKT RC4558   1 2 3 4 5\n*\n  C1   11 12 2.664E-12\n  C2    6  7 20.00E-12\n  DC    5 53 DX\n  DE   54  5 DX\n  DLP  90 91 DX\n  DLN  92 90 DX\n  DP    4  3 DX\n  EGND 99  0 POLY(2) (3,0) (4,0) 0 .5 .5\n  FB    7 99 POLY(5) VB VC VE VLP VLN 0 6.365E6 -6E6 6E6 6E6 -6E6\n  GA 6  0 11 12 418.0E-6\n  GCM   0  6 10 99 6.705E-9\n  IEE   3 10 DC 34.28E-6\n  HLIM 90  0 VLIM 1K\n  Q1   11  2 13 QX\n  Q2   12  1 14 QX\n  R2    6  9 100.0E3\n  RC1   4 11 2.652E3\n  RC2   4 12 2.652E3\n  RE1  13 10 1.122E3\n  RE2  14 10 1.122E3\n  REE  10 99 5.834E6\n  RO1 8  5 125\n  RO2 7 99 125\n  RP    3  4 24.67E3\n  VB    9  0 DC 0\n  VC    3 53 DC 2.600\n  VE   54  4 DC 2.600\n  VLIM  7  8 DC 0\n  VLP  91  0 DC 25\n  VLN   0 92 DC 25\n.MODEL DX D(IS=800.0E-18)\n.MODEL QX PNP(IS=800.0E-18 BF=121.4)\n.ENDS
TEXT -4224 -1248 Left 2 !.MODEL 2SC4793 NPN ( IS=1.8E-09 NF=1.43 BF=146.38 VAF=273 IKF=2.6 NK=0.95 ISE=6.286997E-10 NE=2.223629 BR=4 NR=1 VAR=20 IKR=1.05 RE=0 RB=1.7 RC=1.25 CJE=5.96964E-10 VJE=1.1 MJE=0.5 CJC=5.78E-11 VJC=0.3 MJC=0.3 TF=1.22678E-09 FC=0.5 ITF=10 XTF=99.52253015 TR=983N)
TEXT -4224 -1168 Left 2 !.MODEL 2SA1837 PNP ( IS=2.39372559E-10 NF=1.304015937 BF=300 VAF=273 IKF=2.087725944 NK=0.94719458 ISE=1.46829699E-11 NE=1.526663542 BR=4 NR=1 VAR=20 IKR=1.05 RE=0 RB=1.8 RC=1.65 CJE=4.7407E-10 VJE=1.1 MJE=0.5 CJC=8.6700E-11 VJC=0.3 MJC=0.3 TF=1.642191E-09 FC=0.5 ITF=1.076260106 XTF=5.868994022 TR=1.38U)
TEXT -4224 -1208 Left 2 !.MODEL 2SA1943 PNP (IS=3.5476E-11 BF=159.9 VAF=60 IKF=2.8370 ISE=2.5119E-10 NE=2 BR=25.75 NR=1.011 VAR=11.07 IKR=0.3548 ISC=7.9433E-11 NC=1.37 RE=0.06 RB=2.74 RBM=0.0381 IRB=3.6308m RC=0.01 CJE=4.1783n VJE=0.6354 MJE=0.3374 CJC=1.1383n VJC=0.5 MJC=0.3699 XCJC=0.7624 FC=0.5 EG=1.1751 XTB=1.5306 XTI=3.0)
TEXT -4224 -1288 Left 2 !.MODEL 2SC5200 npn IS=300f BF=100 NF=1 BR=8.025 NR=1 ISE=200p IKF=18 NE=2.0 ISC=2.01764E-10 NC=1.5 VAF=400 VAR=100 IKR=1.39087 RB=1.1 RBM=0.00011 IRB=1.51189E-6 RE=0.0032 RC=0.0183 CJE=6.1n VJE=0.711 MJE=0.304 FC=0.5 CJC=380p VJC=0.84 MJC=0.25 TF=5n TR=3.342E-7 XTB=1.72 EG=0.78 XTI=3
TEXT -4224 -1112 Left 2 !.MODEL 1N4744A D(IS=27.5p RS=0.620 BV=15 IBV=1m N=1.10\n+ CJO=78.3p VJ=1.00 M=0.330 TT=50.1n)

The netlist it stands for:
* amplifier.asc
Q1 N004 0 N024 0 2N5551
Q2 N016 N004 N005 0 mje350
Q3 N048 0 N037 0 2N5401
Q4 N005 N034 N039 0 MJE340
XU1 N028 N041 N038 N025 N042 RC4558  ; pins In+ In- V+ V- OUT
XU2 N043 N029 N038 N025 N031 RC4558  ; pins In+ In- V+ V- OUT
R1 N041 P001 10k
C1 P001 N032 10u
D1 N024 0 1N4148
R2 N024 N003 68k
C2 N024 N003 47p
C3 N004 N003 12p
R3 N029 N028 1k
R4 N029 P002 1k
C4 P002 N031 1n
D2 N029 N035 1N4148
D3 N031 N035 1N4148
R5 N025 N024 12k
R6 N027 N025 2.2k
R7 N031 N024 2.4k
C5 N024 N031 47p
R8 N031 N037 2.4k
C7 P003 N042 22u
R9 N043 P003 4.7k
R10 N043 N003 100k
C8 N046 N003 10p
R11 N043 N046 4.7k
D4 0 N037 1N4148
C9 N037 N003 47p
R12 N037 N003 68k
C6 N031 N037 47p
C10 N048 N003 12p
D5 N048 N039 1N4148
R13 N050 N048 1k
D6 N026 N030 1N4148
D7 N030 N004 1N4148
R14 N027 N050 47
R15 N052 N050 100
C11 N050 N052 180p
R16 N038 N037 12k
R17 N001 N038 2.2k
R18 N034 N033 1.5k
R19 N005 N034 68k
C12 N005 N034 1n
C13 N039 N034 10n
R20 N033 N039 5k
R21 N039 N039 5k
D8 N005 N004 1N4148
C14 N016 N026 180p
R22 N016 N026 100
R23 N001 N026 47
R24 N026 N004 1k
D9 N048 N049 1N4148
D10 N049 N050 1N4148
V1 N027 0 -75
V2 N001 0 75
C15 N026 0 10u
C16 0 N050 10u
R25 N069 N039 47
R26 N069 N053 12k
C17 N069 0 180p
R27 N054 N053 47
R28 N054 N051 150
R29 N051 N047 22
Q6 N053 N069 N027 0 2SA1837
Q5 N027 N054 N051 0 2SA1943
R30 N006 N005 47
R31 N006 N014 12k
C18 0 N006 180p
D11 N014 N040 1N4007
D12 N040 N044 1N4007
D13 N044 N045 1N4007
D14 N045 N053 1N4007
Q7 N001 N006 N014 0 2SC4793
R32 N015 N014 47
R33 N002 N015 150
R34 N047 N002 22
R35 N051 N002 22
Q8 N001 N015 N002 0 2SC5200
R36 N062 N027 10
Q9 N027 N062 N055 0 2SA1943
R37 N037 N055 0.22
Q10 N039 N048 N052 0 MJE340
R38 N063 N027 10
Q11 N027 N063 N056 0 2SA1943
R39 N037 N056 0.22
R40 N064 N027 10
Q12 N027 N064 N057 0 2SA1943
R41 N037 N057 0.22
R42 N065 N027 10
Q13 N027 N065 N058 0 2SA1943
R43 N037 N058 0.22
R44 N066 N027 10
Q14 N027 N066 N059 0 2SA1943
R45 N037 N059 0.22
R46 N067 N027 10
Q15 N027 N067 N060 0 2SA1943
R47 N037 N060 0.22
R48 N068 N027 10
Q16 N027 N068 N061 0 2SA1943
R49 N037 N061 0.22
R50 N007 N002 10
R51 N037 N017 0.22
Q17 N001 N007 N017 0 2SC5200
R52 N008 N002 10
R53 N037 N018 0.22
Q18 N001 N008 N018 0 2SC5200
R54 N009 N002 10
R55 N037 N019 0.22
Q19 N001 N009 N019 0 2SC5200
R56 N010 N002 10
R57 N037 N020 0.22
Q20 N001 N010 N020 0 2SC5200
R58 N011 N002 10
R59 N037 N021 0.22
Q21 N001 N011 N021 0 2SC5200
R60 N012 N002 10
R61 N037 N022 0.22
Q22 N001 N012 N022 0 2SC5200
R62 N013 N002 10
R63 N037 N023 0.22
Q23 N001 N013 N023 0 2SC5200
R64 N037 0 8
R65 N037 0 10
C19 N037 0 100n
V3 N032 0 SINE(0 1 1k)
C20 N036 N041 47p
R66 N036 N041 43k
C21 0 N025 100u
C22 0 N025 100n
C23 N038 0 100u
C24 N038 0 100n
D15 0 N038 1N4744A
D16 N025 0 1N4744A
.model D D
.lib standard.dio
.model NPN NPN
.model PNP PNP
.lib standard.bjt
.tran 0 10m 0 100u
.MODEL 2N5401_Cordell pnp IS=25f BF=220 VAF=196 IKF=0.2 ISE=2f NE=1.4 NF=1 RB=60 RC=2 RE=0.1 CJE=35p MJE=0.40 VJE=0.75 CJC=15p MJC=0.55 VJC=0.75 FC=0.5 TF=800p XTF=60 VTF=0 ITF=4 TR=1.5n BR=4 IKR=0 EG=1.1 XTB=1.5 XTI=3 NC=2 ISC=0 mfg=CA031011
.MODEL mje340 NPN(IS=1.03431e-13 BF=172.974 NF=0.939811 VAF=27.3487 IKF=0.0260146 ISE=4.48447e-11 NE=1.61605 BR=16.6725 NR=0.796984 VAR=6.11596 IKR=0.10004 ISC=9.99914e-14 NC=1.99995 RB=1.47761 IRB=0.2 RBM=1.47761 RE=0.0001 RC=1.42228 XTB=2.70726 XTI=1 EG=1.206 CJE=1e-11 VJE=0.75 MJE=0.33 TF=1e-09 XTF=1 VTF=10 ITF=0.01 CJC=1e-11 VJC=0.75 MJC=0.33 XCJC=0.9 FC=0.5 CJS=0 VJS=0.75 MJS=0.5 TR=1e-07 PTF=0 Vceo=300 Icrating=0.5A mfg=OnSemi)
.MODEL mje350 PNP(IS=6.01619f BF=157.387 NF=0.910131 VAF=23.273 IKF=0.0564808 ISE=4.48479p NE=1.58557 BR=0.1 NR=1.03823 VAR=4.14543 IKR=0.0999978 ISC=1.00199e-13 NC=1.98851 RB=0.1 IRB=0.202965 RBM=0.1 RE=0.0710678 RC=0.355339 XTB=1.03638 XTI=3.8424 EG=1.206 CJE=1e-11 VJE=0.75 MJE=0.33 TF=1e-09 XTF=1 VTF=10 ITF=0.01 CJC=1e-11 VJC=0.75 MJC=0.33 XCJC=0.9 FC=0.5 CJS=0 VJS=0.75 MJS=0.5 TR=1e-07 PTF=0 Vceo=300 Icrating=0.5A mfg=OnSemi)
.MODEL 2N5551 NPN(IS=2.511f ISE=2.511f ISC=0 XTI=3 BF=242.6 BR=3.197 IKF=0.3458 IKR=0 XTB=1.5 VAF=100 VAR=30 VJE=0.65 VJC=0.65 RE=0.1 RC=1 RB=10 CJE=18.79p CJC=4.883p XCJC=0.75 FC=0.5 NF=1 NR=1 NE=1.249 NC=2 MJE=0.3416 MJC=0.3047 TF=560p TR=1.202n ITF=50m VTF=5 XTF=8 EG=1.11 VCEO=180 ICRATING=600m MFG=NSC)
.SUBCKT RC4558   1 2 3 4 5
*
  C1   11 12 2.664E-12
  C2    6  7 20.00E-12
  DC    5 53 DX
  DE   54  5 DX
  DLP  90 91 DX
  DLN  92 90 DX
  DP    4  3 DX
  EGND 99  0 POLY(2) (3,0) (4,0) 0 .5 .5
  FB    7 99 POLY(5) VB VC VE VLP VLN 0 6.365E6 -6E6 6E6 6E6 -6E6
  GA 6  0 11 12 418.0E-6
  GCM   0  6 10 99 6.705E-9
  IEE   3 10 DC 34.28E-6
  HLIM 90  0 VLIM 1K
  Q1   11  2 13 QX
  Q2   12  1 14 QX
  R2    6  9 100.0E3
  RC1   4 11 2.652E3
  RC2   4 12 2.652E3
  RE1  13 10 1.122E3
  RE2  14 10 1.122E3
  REE  10 99 5.834E6
  RO1 8  5 125
  RO2 7 99 125
  RP    3  4 24.67E3
  VB    9  0 DC 0
  VC    3 53 DC 2.600
  VE   54  4 DC 2.600
  VLIM  7  8 DC 0
  VLP  91  0 DC 25
  VLN   0 92 DC 25
.MODEL DX D(IS=800.0E-18)
.MODEL QX PNP(IS=800.0E-18 BF=121.4)
.ENDS
.MODEL 2SC4793 NPN ( IS=1.8E-09 NF=1.43 BF=146.38 VAF=273 IKF=2.6 NK=0.95 ISE=6.286997E-10 NE=2.223629 BR=4 NR=1 VAR=20 IKR=1.05 RE=0 RB=1.7 RC=1.25 CJE=5.96964E-10 VJE=1.1 MJE=0.5 CJC=5.78E-11 VJC=0.3 MJC=0.3 TF=1.22678E-09 FC=0.5 ITF=10 XTF=99.52253015 TR=983N)
.MODEL 2SA1837 PNP ( IS=2.39372559E-10 NF=1.304015937 BF=300 VAF=273 IKF=2.087725944 NK=0.94719458 ISE=1.46829699E-11 NE=1.526663542 BR=4 NR=1 VAR=20 IKR=1.05 RE=0 RB=1.8 RC=1.65 CJE=4.7407E-10 VJE=1.1 MJE=0.5 CJC=8.6700E-11 VJC=0.3 MJC=0.3 TF=1.642191E-09 FC=0.5 ITF=1.076260106 XTF=5.868994022 TR=1.38U)
.MODEL 2SA1943 PNP (IS=3.5476E-11 BF=159.9 VAF=60 IKF=2.8370 ISE=2.5119E-10 NE=2 BR=25.75 NR=1.011 VAR=11.07 IKR=0.3548 ISC=7.9433E-11 NC=1.37 RE=0.06 RB=2.74 RBM=0.0381 IRB=3.6308m RC=0.01 CJE=4.1783n VJE=0.6354 MJE=0.3374 CJC=1.1383n VJC=0.5 MJC=0.3699 XCJC=0.7624 FC=0.5 EG=1.1751 XTB=1.5306 XTI=3.0)
.MODEL 2SC5200 npn IS=300f BF=100 NF=1 BR=8.025 NR=1 ISE=200p IKF=18 NE=2.0 ISC=2.01764E-10 NC=1.5 VAF=400 VAR=100 IKR=1.39087 RB=1.1 RBM=0.00011 IRB=1.51189E-6 RE=0.0032 RC=0.0183 CJE=6.1n VJE=0.711 MJE=0.304 FC=0.5 CJC=380p VJC=0.84 MJC=0.25 TF=5n TR=3.342E-7 XTB=1.72 EG=0.78 XTI=3
.MODEL 1N4744A D(IS=27.5p RS=0.620 BV=15 IBV=1m N=1.10
+ CJO=78.3p VJ=1.00 M=0.330 TT=50.1n)
.backanno
.end